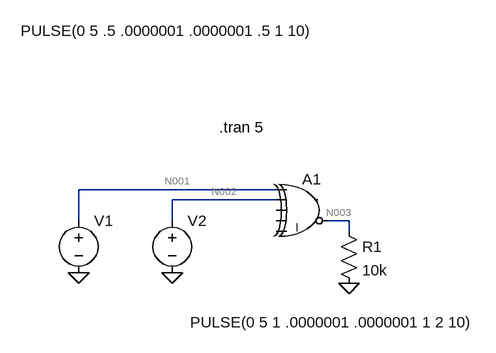
[diagram p0: schematic Draft3.asc]
Draft3.asc, the LTspice schematic file:
Version 4
SHEET 1 880 680
WIRE 288 272 -16 272
WIRE 288 288 128 288
WIRE -16 320 -16 272
WIRE 128 320 128 288
WIRE 400 320 368 320
WIRE 400 336 400 320
FLAG 128 400 0
FLAG -16 400 0
FLAG 400 416 0
SYMBOL voltage 128 304 R0
WINDOW 3 28 172 Left 2
SYMATTR InstName V2
SYMATTR Value PULSE(0 5 1 .0000001 .0000001 1 2 10)
SYMBOL res 384 320 R0
SYMATTR InstName R1
SYMATTR Value 10k
SYMBOL voltage -16 304 R0
WINDOW 3 -89 -276 Left 2
SYMATTR InstName V1
SYMATTR Value PULSE(0 5 .5 .0000001 .0000001 .5 1 10)
SYMBOL Digital/xor 336 240 R0
SYMATTR InstName A1
TEXT 200 176 Left 2 !.tran 5

The netlist it stands for:
* Draft3.asc
V2 N002 0 PULSE(0 5 1 .0000001 .0000001 1 2 10)
R1 N003 0 10k
V1 N001 0 PULSE(0 5 .5 .0000001 .0000001 .5 1 10)
A1 N001 N002 0 0 0 N003 0 0 XOR
.tran 5
.backanno
.end

* Results of the author's LTspice run, read from the files saved beside the schematic
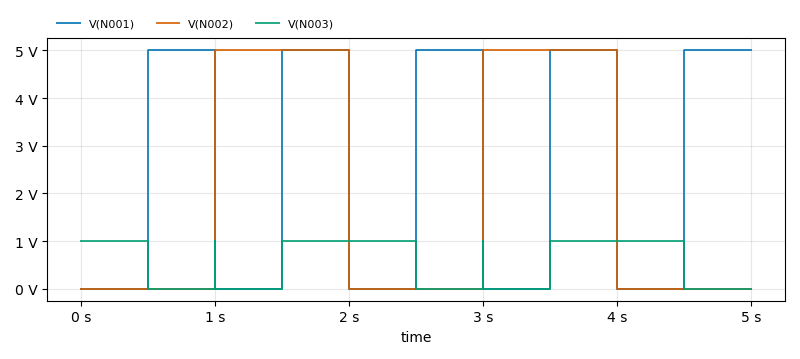
[diagram p1: Transient Analysis of Draft3.asc, plotted from the saved traces]
* Transient Analysis, 1 run:
*   V(N001): min 0 V, max 5 V, average 2.5 V, rms 3.536 V, last 5 V
*   V(N002): min 0 V, max 5 V, average 2 V, rms 3.162 V, last 0 V
*   V(N003): min 0 V, max 999.9 mV, average 500 mV, rms 707 mV, last 0 V